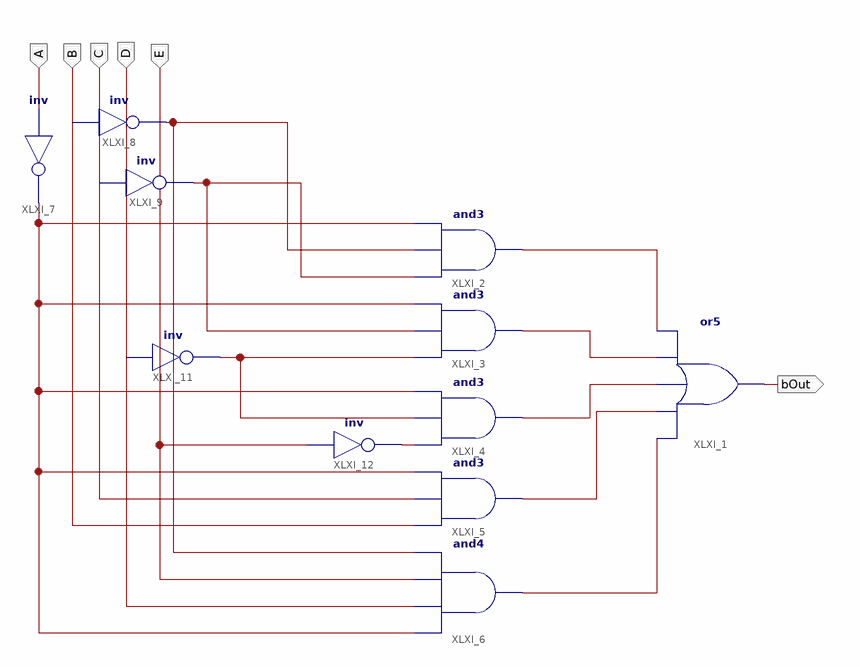
[diagram p0: schematic sheet 1]
// Xilinx ISE schematic b.sch (xa9500xl) as structural Verilog: 11 symbols, 6 ports
module b (
  input  A,
  input  B,
  input  C,
  input  D,
  input  E,
  output bOut
);

  wire XLXN_6, XLXN_7, XLXN_8, XLXN_9, XLXN_11, XLXN_15, XLXN_22, XLXN_25, XLXN_27, XLXN_28;

  or XLXI_1 (bOut, XLXN_11, XLXN_9, XLXN_8, XLXN_7, XLXN_6);
  and XLXI_2 (XLXN_6, XLXN_25, XLXN_22, XLXN_15);
  and XLXI_3 (XLXN_7, XLXN_27, XLXN_25, XLXN_15);
  and XLXI_4 (XLXN_8, XLXN_28, XLXN_27, XLXN_15);
  and XLXI_5 (XLXN_9, B, C, XLXN_15);
  and XLXI_6 (XLXN_11, XLXN_15, D, E, XLXN_22);
  not XLXI_7 (XLXN_15, A);
  not XLXI_8 (XLXN_22, B);
  not XLXI_9 (XLXN_25, C);
  not XLXI_11 (XLXN_27, D);
  not XLXI_12 (XLXN_28, E);
endmodule
